# EAGLE design DAC_repro (EAGLE 5.06)

## Sheet 1 of 3
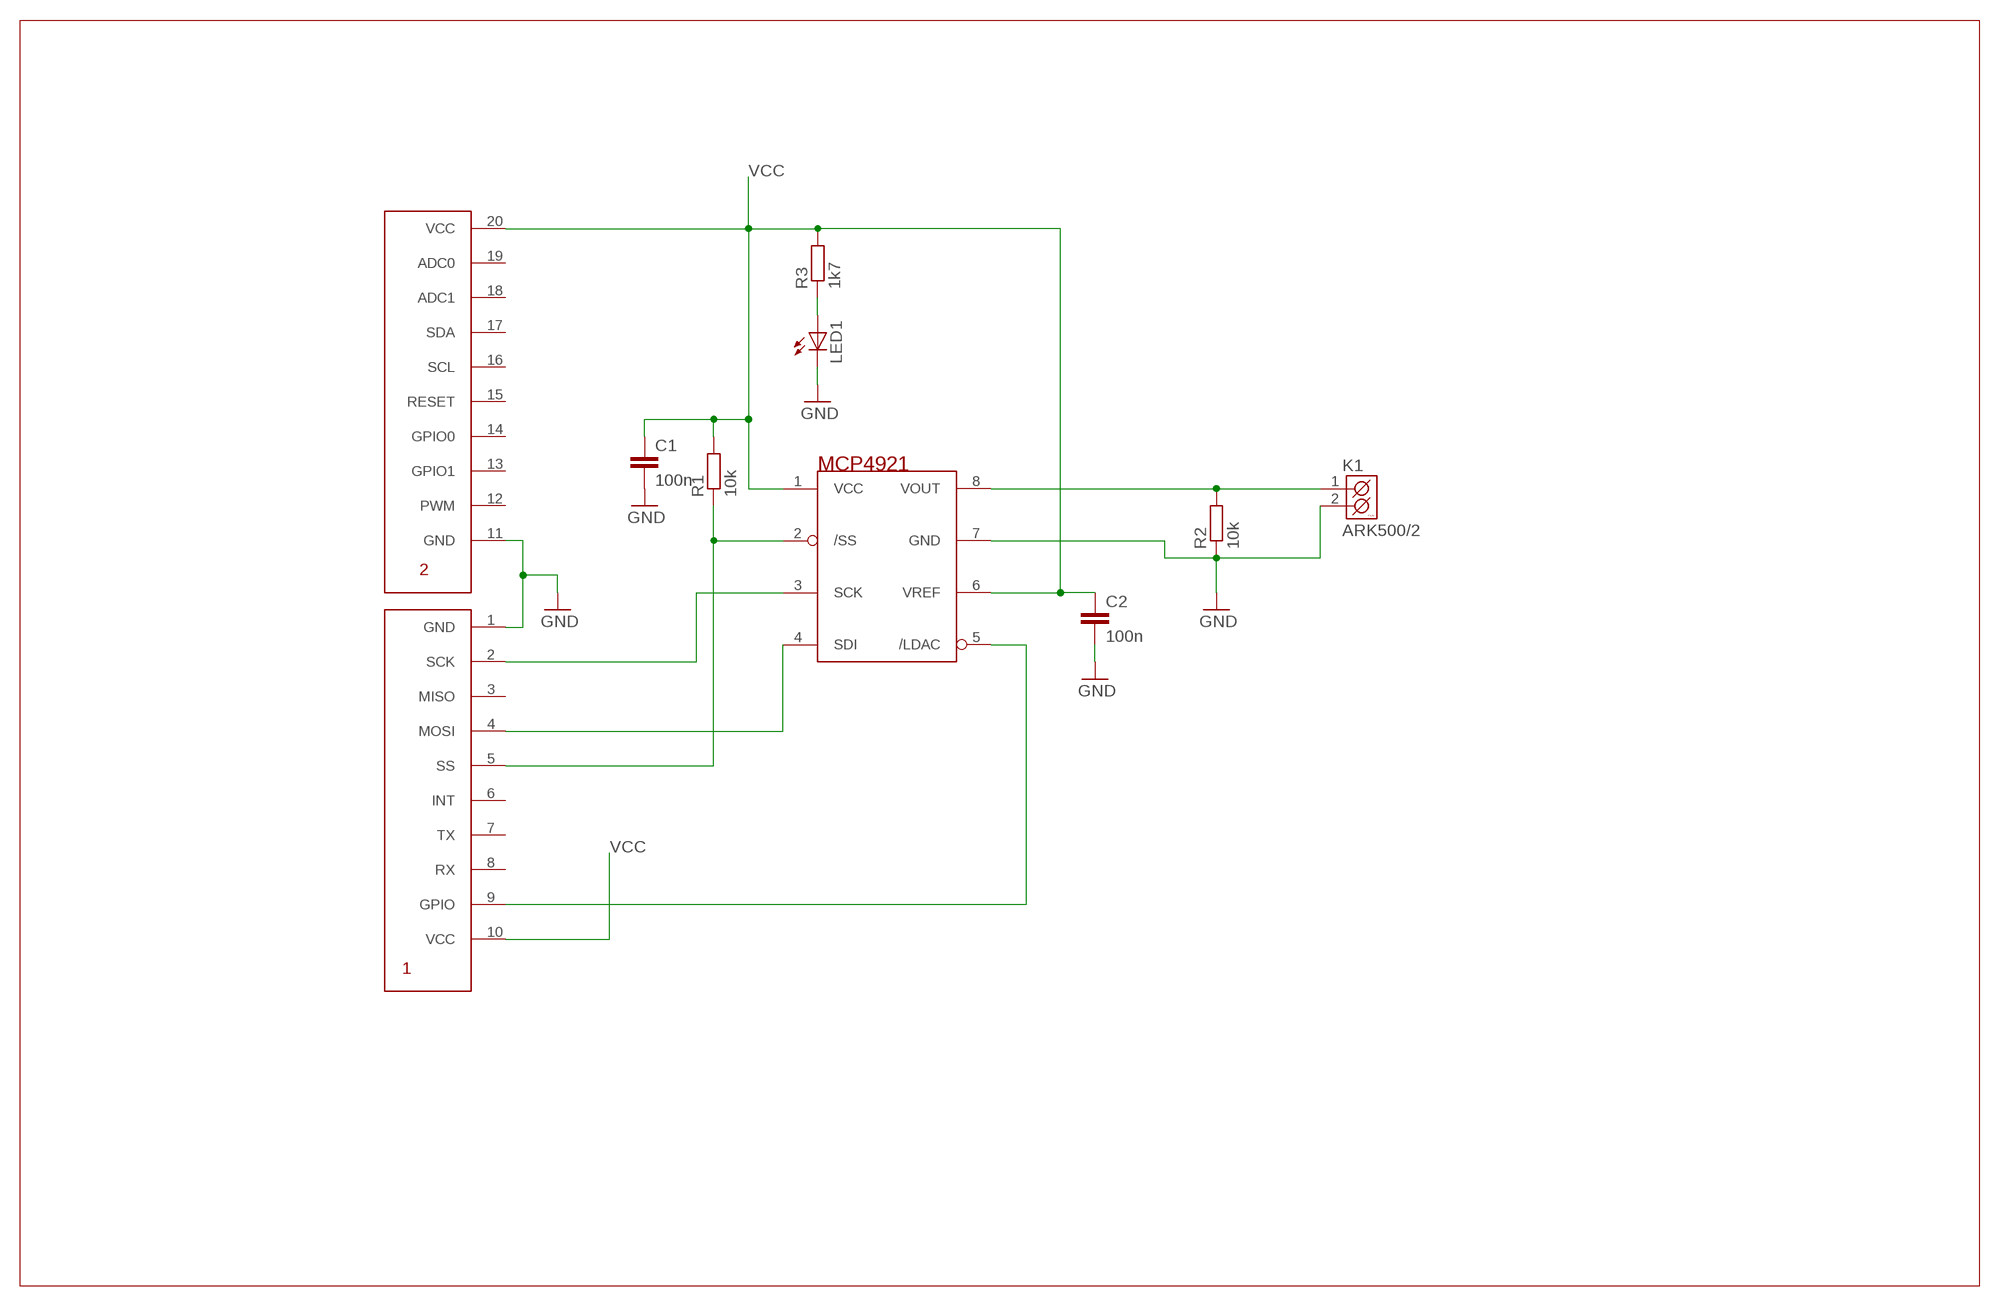
[diagram p0: schematic, sheet 1]

### Parts
C1  100n  C-EUC1206  [C1206]
C2  100n  C-EUC1206  [C1206]
K1  ARK500/2  [ARK500/2]
LED1  LEDCHIPLED_1206  [CHIPLED_1206]
MCP4921  MCP49XX  [DIL08]
MM1  MMSYS_CONECTOR  [MMSYSTEMS_CON]
R1  10k  R-EU_R1206  [R1206]
R2  10k  R-EU_R1206  [R1206]
R3  1k7  R-EU_M1206  [M1206]

### Nets
GND: C1.2 C2.2 K1.2(K2) LED1.C MCP4921.7(GND) MM1.1(GND) MM1.11(GND) R2.1
N$1: MCP4921.2(/SS) MM1.5(SS) R1.1
N$2: MCP4921.4(SDI) MM1.4(MOSI)
N$3: LED1.A R3.1
N$4: MCP4921.3(SCK) MM1.2(SCK)
N$6: MCP4921.5(/LDAC) MM1.9(GPIO)
N$7: K1.1(K1) MCP4921.8(VOUT) R2.2
VCC: C1.1 C2.1 MCP4921.1(VCC) MCP4921.6(VREF) MM1.10(VCC) MM1.20(VCC) R1.2 R3.2
Unconnected: MM1.3(MISO) MM1.6(INT) MM1.7(TX) MM1.8(RX) MM1.12(PWM) MM1.13(GPIO1) MM1.14(GPIO0) MM1.15(RESET) MM1.16(SCL) MM1.17(SDA) MM1.18(ADC1) MM1.19(ADC0)

## Sheet 2 of 3
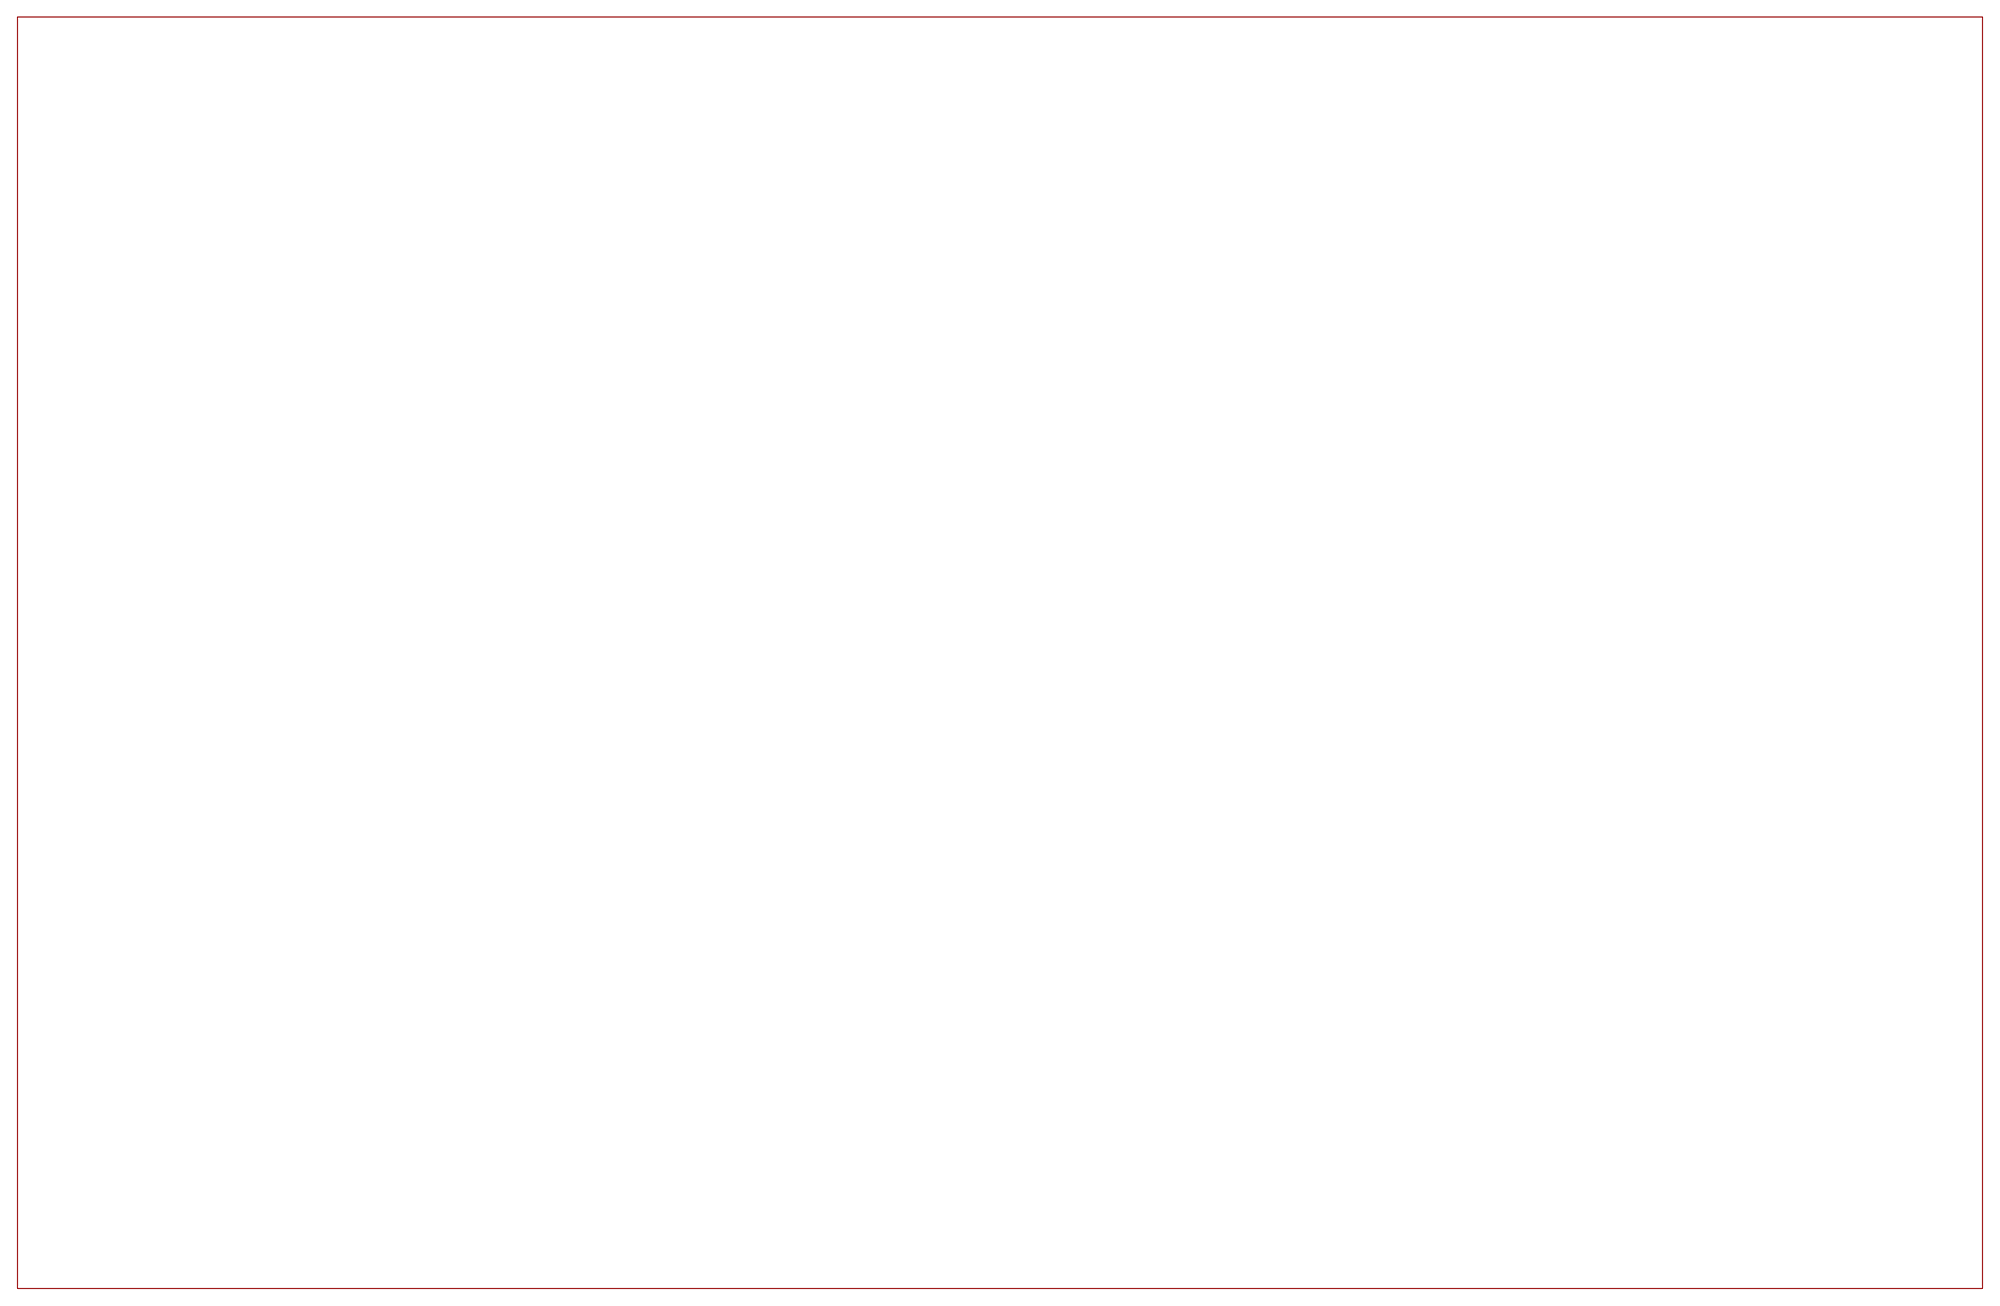
[diagram p1: schematic, sheet 2]

## Sheet 3 of 3
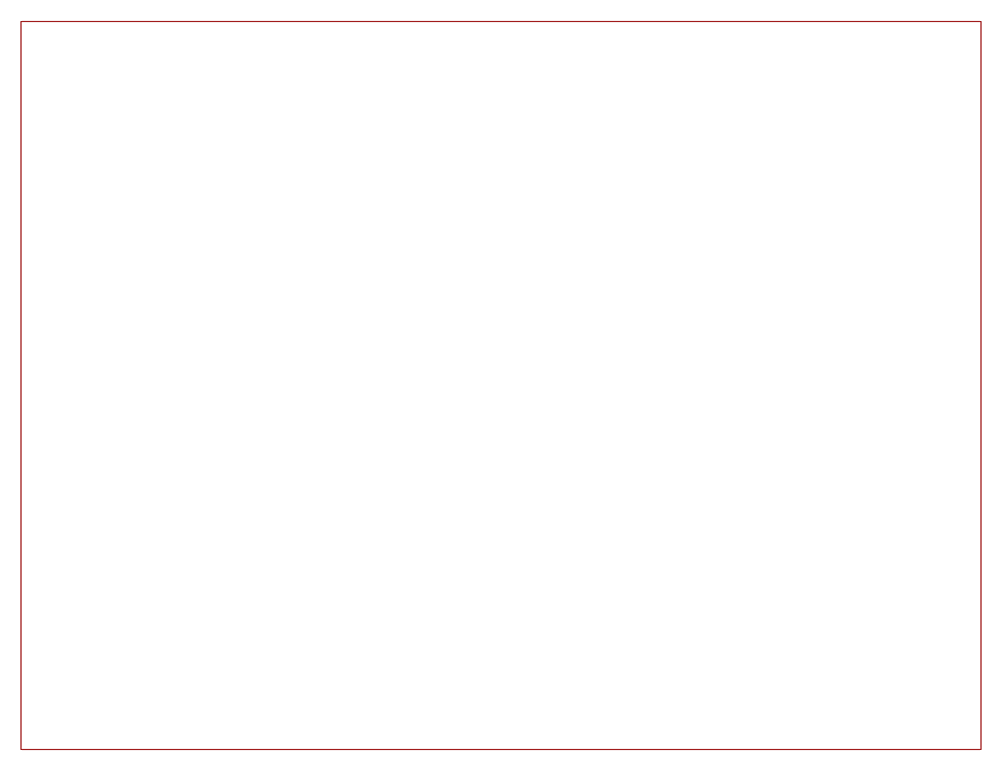
[diagram p2: schematic, sheet 3]

## Library data of the parts
C1 C2 = resistor:C-EU: CAPACITOR, European symbol
K1 = #PaJa_konektory:ARK500/2: Svorkovnice - roztec 5mm - dvojita
LED1 = led:LED: LED OSRAM: - CHIPLED LG R971, LG N971, LY N971, LG Q971, LY Q971, LO R971, LY R971 LH N974, LH R974 LS Q976, LO Q976, LY Q976 LO Q996 - Hyper CHIPLED LW Q18S LB Q993, LB Q99A, LB R99A - SideLED LS A670, LO A670, LY A670, LG A670, LP A670 LB A673, LV A673, LT A673, LW A673 LH A674 LY A675 LS A676, LA A676, LO A676, LY A676, LW A676 LS A679, LY A679, LG A679 - Hyper Micro SIDELED® LS Y876, LA Y876, LO Y876, LY Y876 LT Y87S - SmartLED LW L88C, LW L88S LB L89C, LB L89S, LG L890 LS L89K, LO L89K, LY L89K LS L896, LA L896, LO L896, LY L896 - TOPLED LS T670, LO T670, LY T670, LG T670, LP T670 LSG T670, LSP T670, LSY T670, LOP T670, LYG T670 LG T671, LOG T671, LSG T671 LB T673, LV T673, LT T673, LW T673 LH T674 LS T676, LA T676, LO T676, LY T676, LB T676, LH T676, LSB T676, LW T676 LB T67C, LV T67C, LT T67C, LS T67K, LO T67K, LY T67K, LW E67C LS E67B, LA E67B, LO E67B, LY E67B, LB E67C, LV E67C, LT E67C LW T67C LS T679, LY T679, LG T679 LS T770, LO T770, LY T770, LG T770, LP T770 LB T773, LV T773, LT T773, LW T773 LH T774 LS E675, LA E675, LY E675, LS T675 LS T776, LA T776, LO T776, LY T776, LB T776 LHGB T686 LT T68C, LB T68C - Hyper Mini TOPLED® LB M676 - Mini TOPLED Santana® LG M470 LS M47K, LO M47K, LY M47K Source: http://www.osram.convergy.de LUXEON: - LUMILED® LXK2-PW12-R00, LXK2-PW12-S00, LXK2-PW14-U00, LXK2-PW14-V00 LXK2-PM12-R00, LXK2-PM12-S00, LXK2-PM14-U00 LXK2-PE12-Q00, LXK2-PE12-R00, LXK2-PE12-S00, LXK2-PE14-T00, LXK2-PE14-U00 LXK2-PB12-K00, LXK2-PB12-L00, LXK2-PB12-M00, LXK2-PB14-N00, LXK2-PB14-P00, LXK2-PB14-Q00 LXK2-PR12-L00, LXK2-PR12-M00, LXK2-PR14-Q00, LXK2-PR14-R00 LXK2-PD12-Q00, LXK2-PD12-R00, LXK2-PD12-S00 LXK2-PH12-R00, LXK2-PH12-S00 LXK2-PL12-P00, LXK2-PL12-Q00, LXK2-PL12-R00 Source: www.luxeon.com KINGBRIGHT: KA-3528ASYC Source: www.kingbright.com
MCP4921 = at90,:MCP49XX
MM1 = atmega16u4:MMSYS_CONECTOR
R1-R3 = resistor:R-EU_: RESISTOR, European symbol

## Board
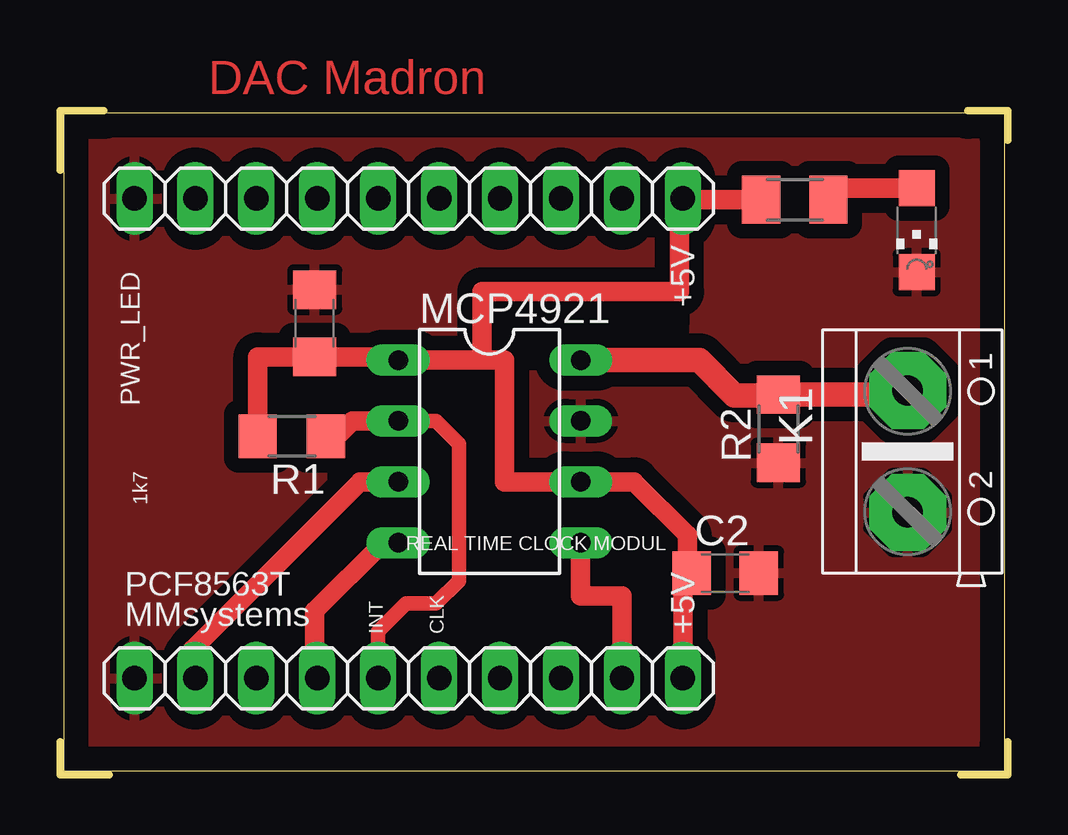
[diagram p3: board, top side]

Size 39.52 x 27.68 mm. Coordinates in mm from the lower left corner, seen from the top.
Outline: 0,25.21 0,27.68 1.82,27.68
Outline: 2.05,0 0,0 0,1.38
Outline: 37.56,0 39.52,0 39.52,1.38
Outline: 39.52,26.46 39.52,27.68 37.85,27.68
Outline: 0.15,0.17 39.38,0.17 39.38,27.57 0.15,27.57 0.15,0.17
Copper layers (1*16): Top 0.035mm / dielectric 1.5mm / Bottom 0.035mm
Design rules "default": minimum track width 10mil, minimum drill 24mil, track to track 8mil, track to pad 8mil, pad to pad 8mil, via to via 8mil, smd to smd 8mil, copper to edge 40mil, drill to drill 8mil, minimum pad ring 10mil, minimum via ring 8mil, stop-mask expansion 4mil, vias tented up to drill 0mil, thermal gap 10mil
tRestrict: 1 lines

### Footprints (pad centres in the part's own frame; a part is rotated, then mirrored left to right if it is on the bottom)
C1206 = smd 1.6 x 1.8: 1 -1.4,0; 2 1.4,0
ARK500/2 = drill 1.27 pad 3.2 octagon: 1 -2.54,0; 2 2.54,0
CHIPLED_1206 = smd 1.5 x 1.5: A 0,-1.75; C 0,1.75
DIL08 = drill 0.813 long: 1 -3.81,-3.81; 2 -1.27,-3.81; 3 1.27,-3.81; 4 3.81,-3.81; 5 3.81,3.81; 6 1.27,3.81; 7 -1.27,3.81; 8 -3.81,3.81
MMSYSTEMS_CON = drill 1.016 long: 1 2,1; 2 4.54,1; 3 7.08,1; 4 9.62,1; 5 12.16,1; 6 14.7,1; 7 17.24,1; 8 19.78,1; 9 22.32,1; 10 24.86,1; 11 2,21; 12 4.54,21; 13 7.08,21; 14 9.62,21; 15 12.16,21; 16 14.7,21; 17 17.24,21; 18 19.78,21; 19 22.32,21; 20 24.86,21
R1206 = smd 1.6 x 1.803: 1 -1.422,0; 2 1.422,0
M1206 = smd 1.6 x 2: 1 -1.4,0; 2 1.4,0

### Placement (x,y rotation side)
C1  10.62,18.82 90 top
C2  27.73,8.41 0 top
K1  35.34,13.48 270 top
LED1  35.71,22.7 180 top
MCP4921  17.9,13.48 270 top
MM1  1.1,3.02 0 top
R1  9.66,14.11 180 top
R2  29.95,14.43 90 top
R3  30.63,23.97 180 top

### Tracks (layer width: path | path; a pad name or v marks a point on that pad's centre or on a via)
GND
  pour Top (isolate 0.61): -3.02,-3.96 41.36,-3.64 41.36,30.6 -3.02,30.28
N$1
  Top 0.61: MM1.5 13.26,5.99 14.42,7.14 15.68,7.14 16.64,8.09 16.64,13.8 15.68,14.75 MCP4921.2
  Top 0.813: R1.1 11.56,14.11 12.2,14.75 MCP4921.2
N$2
  Top 0.813: MCP4921.4 13.46,9.67 10.61,6.82 10.61,4.13 MM1.4
N$3
  Top 0.813: R3.1 31.71,24.45 LED1.A
N$4
  Top 0.813: MCP4921.3 12.51,12.21 5.54,5.24 5.54,4.13 MM1.2
N$6
  Top 0.813: MCP4921.5 21.71,7.46 23.43,7.46 MM1.9
N$7
  Top 1.016: MCP4921.8 26.65,17.29 28.12,15.82 29.92,15.82 R2.2 35.17,15.85 K1.1
VCC
  Top 0.813: R3.2 25.96,23.97 MM1.20 25.83,24.02 25.83,20.14 17.59,20.14 17.59,17.29 | R1.2 8.24,17.42 C1.1 14.09,17.42 MCP4921.1 17.59,17.29 | 17.59,17.29 18.54,17.29 18.54,12.21 MCP4921.6 23.93,12.21 26.15,9.99 26.15,8.59 C2.1 25.96,8.04 MM1.10

### Text on the board
Top: DAC Madron
tNames: +5V | PWR_LED | 1k7 | REAL TIME CLOCK MODUL | PCF8563T | MMsystems | INT | CLK | +5V